# Altium schematic sheet TopLevelDesign.SchDoc
size A4; SheetNumber: 1; SheetTotal: 3
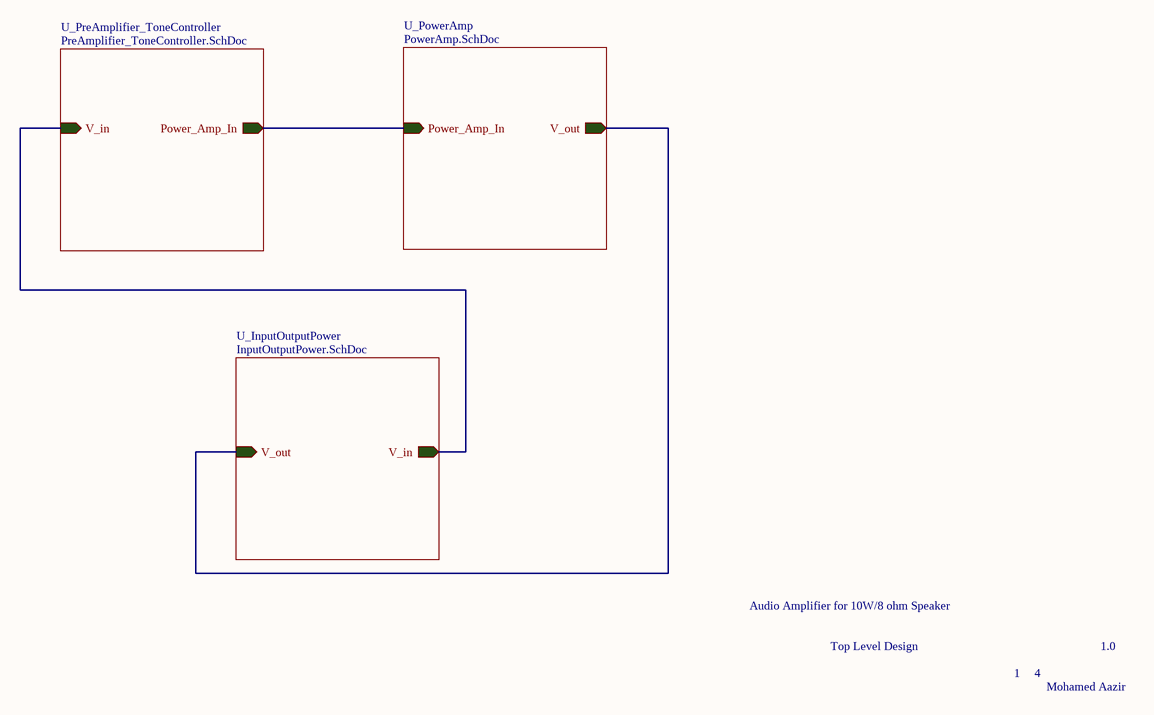
[diagram p0: TopLevelDesign.SchDoc]

## Sub-sheets
U_InputOutputPower = InputOutputPower.SchDoc: V_out (in), V_in (out)
U_PowerAmp = PowerAmp.SchDoc: Power_Amp_In (in), V_out (out)
U_PreAmplifier_ToneController = PreAmplifier_ToneController.SchDoc: V_in (in), Power_Amp_In (out)

## Nets
(unnamed): sheet U_PreAmplifier_ToneController/V_in, sheet U_InputOutputPower/V_in
(unnamed): sheet U_PreAmplifier_ToneController/Power_Amp_In, sheet U_PowerAmp/Power_Amp_In
(unnamed): sheet U_PowerAmp/V_out, sheet U_InputOutputPower/V_out

## Notes on the sheet
- Audio Amplifier for 10W/8 ohm Speaker
- Top Level Design
- 1
- 4
- 1.0
- Mohamed Aazir